# Altium schematic sheet rk3288.SchDoc
size A4
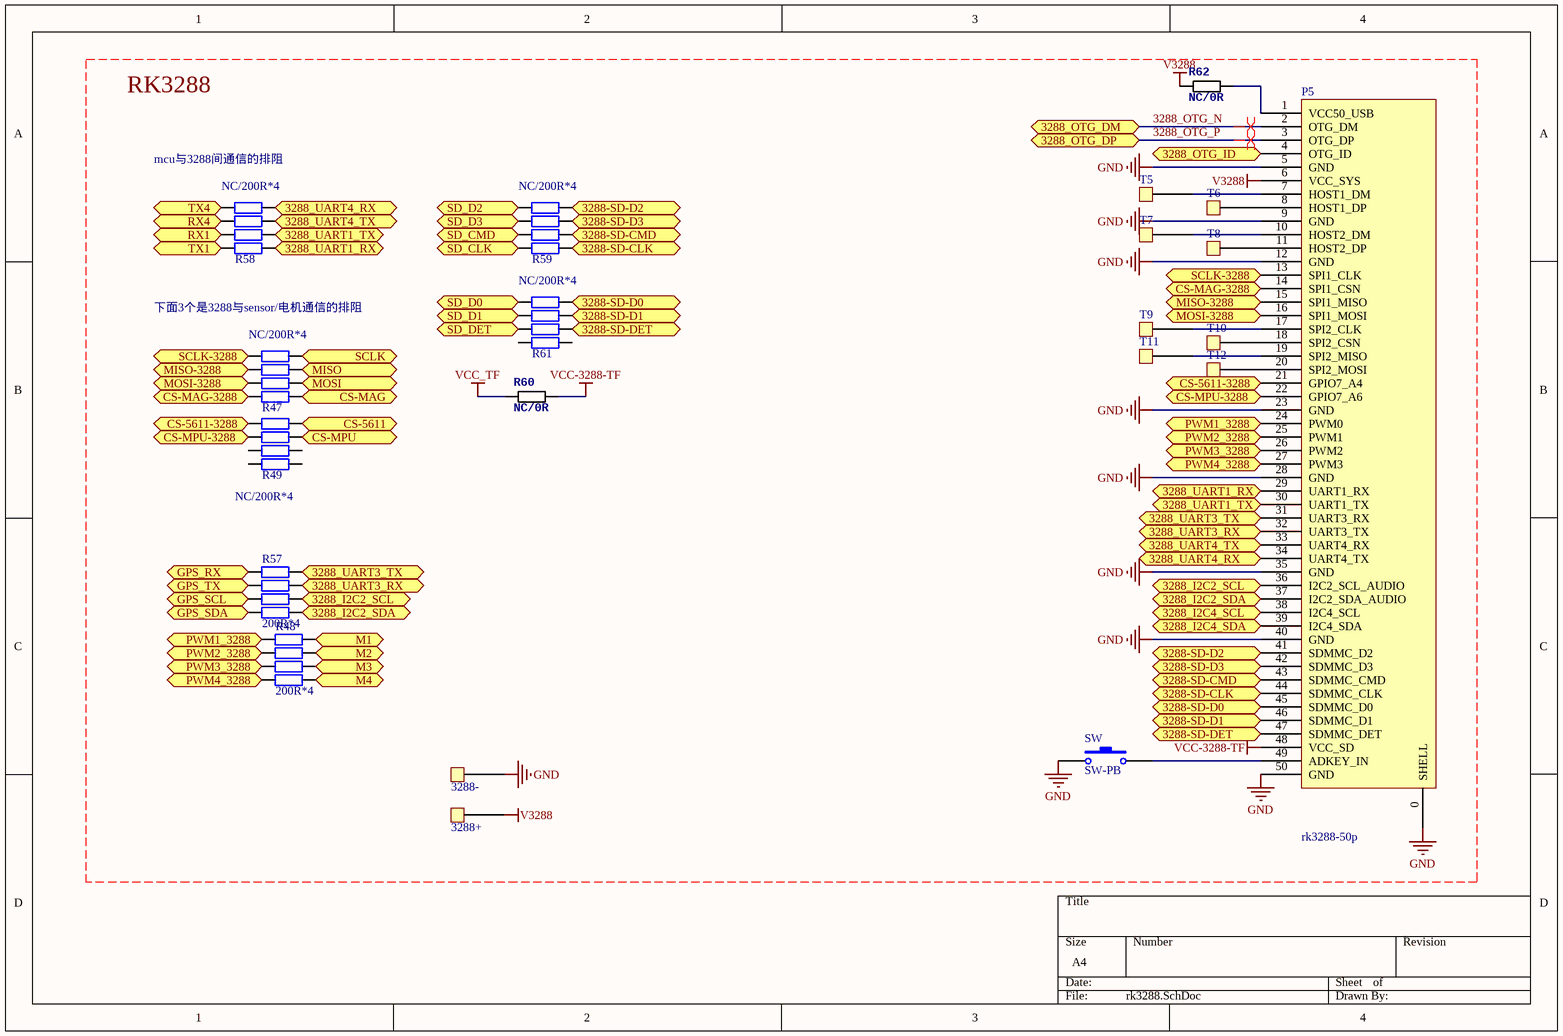
[diagram p0: rk3288.SchDoc]

## Parts
3288+  TestPad  [BatteryHole - 2mm]  (value not drawn)
3288-  TestPad  [BatteryHole - 2mm]  (value not drawn)
P5  rk3288-50p  [FPC-0.5mm-50-revert]
R47  NC/200R*4  [0402X4]
R48  200R*4  [0402X4]
R49  NC/200R*4  [0402X4]
R57  200R*4  [0402X4]
R58  NC/200R*4  [0402X4]
R59  NC/200R*4  [0402X4]
R60  NC/0R  [0402]
R61  NC/200R*4  [0402X4]
R62  NC/0R  [0402]
SW  SW-PB  [SW1]
T5  TestPad  [TestPad - 1mm]  (value not drawn)
T6  TestPad  [TestPad - 1mm]  (value not drawn)
T7  TestPad  [TestPad - 1mm]  (value not drawn)
T8  TestPad  [TestPad - 1mm]  (value not drawn)
T9  TestPad  [TestPad - 1mm]  (value not drawn)
T10  TestPad  [TestPad - 1mm]  (value not drawn)
T11  TestPad  [TestPad - 1mm]  (value not drawn)
T12  TestPad  [TestPad - 1mm]  (value not drawn)

## Ports
3288-SD-CLK, 3288-SD-CMD, 3288-SD-D0, 3288-SD-D1, 3288-SD-D2, 3288-SD-D3, 3288-SD-DET, 3288_I2C2_SCL, 3288_I2C2_SDA, 3288_I2C4_SCL, 3288_I2C4_SDA, 3288_OTG_DM, 3288_OTG_DP, 3288_OTG_ID, 3288_UART1_RX, 3288_UART1_TX, 3288_UART3_RX, 3288_UART3_TX, 3288_UART4_RX, 3288_UART4_TX, CS-5611, CS-5611-3288, CS-MAG (bidir), CS-MAG-3288 (bidir), CS-MPU, CS-MPU-3288, GPS_RX, GPS_SCL, GPS_SDA, GPS_TX, M1, M2, M3, M4, MISO, MISO-3288, MOSI, MOSI-3288, PWM1_3288, PWM2_3288, PWM3_3288, PWM4_3288, RX1, RX4, SCLK, SCLK-3288, SD_CLK, SD_CMD, SD_D0, SD_D1, SD_D2, SD_D3, SD_DET, TX1, TX4

## Nets
GND: 3288-.1 P5.0(SHELL) P5.5(GND) P5.9(GND) P5.12(GND) P5.23(GND) P5.28(GND) P5.35(GND) P5.40(GND) P5.50(GND) SW.1
V3288: 3288+.1 P5.6(VCC_SYS) R62.1
VCC-3288-TF: P5.48(VCC_SD) R60.2
VCC_TF: R60.1
3288-SD-CLK: P5.44(SDMMC_CLK) R59.5 ; port 3288-SD-CLK
3288-SD-CMD: P5.43(SDMMC_CMD) R59.6 ; port 3288-SD-CMD
3288-SD-D0: P5.45(SDMMC_D0) R61.8 ; port 3288-SD-D0
3288-SD-D1: P5.46(SDMMC_D1) R61.7 ; port 3288-SD-D1
3288-SD-D2: P5.41(SDMMC_D2) R59.8 ; port 3288-SD-D2
3288-SD-D3: P5.42(SDMMC_D3) R59.7 ; port 3288-SD-D3
3288-SD-DET: P5.47(SDMMC_DET) R61.6 ; port 3288-SD-DET
3288_I2C2_SCL: P5.36(I2C2_SCL_AUDIO) R57.2 ; port 3288_I2C2_SCL
3288_I2C2_SDA: P5.37(I2C2_SDA_AUDIO) R57.1 ; port 3288_I2C2_SDA
3288_I2C4_SCL: P5.38(I2C4_SCL) ; port 3288_I2C4_SCL
3288_I2C4_SDA: P5.39(I2C4_SDA) ; port 3288_I2C4_SDA
3288_OTG_ID: P5.4(OTG_ID) ; port 3288_OTG_ID
3288_OTG_N: P5.2(OTG_DM) ; port 3288_OTG_DM
3288_OTG_P: P5.3(OTG_DP) ; port 3288_OTG_DP
3288_UART1_RX: P5.29(UART1_RX) R58.5 ; port 3288_UART1_RX
3288_UART1_TX: P5.30(UART1_TX) R58.6 ; port 3288_UART1_TX
3288_UART3_RX: P5.32(UART3_TX) R57.3 ; port 3288_UART3_RX
3288_UART3_TX: P5.31(UART3_RX) R57.4 ; port 3288_UART3_TX
3288_UART4_RX: P5.34(UART4_TX) R58.8 ; port 3288_UART4_RX
3288_UART4_TX: P5.33(UART4_RX) R58.7 ; port 3288_UART4_TX
CS-5611: R49.8 ; port CS-5611
CS-5611-3288: P5.21(GPIO7_A4) R49.1 ; port CS-5611-3288
CS-MAG: R47.5 ; port CS-MAG
CS-MAG-3288: P5.14(SPI1_CSN) R47.4 ; port CS-MAG-3288
CS-MPU: R49.7 ; port CS-MPU
CS-MPU-3288: P5.22(GPIO7_A6) R49.2 ; port CS-MPU-3288
GPS_RX: R57.5 ; port GPS_RX
GPS_SCL: R57.7 ; port GPS_SCL
GPS_SDA: R57.8 ; port GPS_SDA
GPS_TX: R57.6 ; port GPS_TX
M1: R48.1 ; port M1
M2: R48.2 ; port M2
M3: R48.3 ; port M3
M4: R48.4 ; port M4
MISO: R47.7 ; port MISO
MISO-3288: P5.15(SPI1_MISO) R47.2 ; port MISO-3288
MOSI: R47.6 ; port MOSI
MOSI-3288: P5.16(SPI1_MOSI) R47.3 ; port MOSI-3288
PWM1_3288: P5.24(PWM0) R48.8 ; port PWM1_3288
PWM2_3288: P5.25(PWM1) R48.7 ; port PWM2_3288
PWM3_3288: P5.26(PWM2) R48.6 ; port PWM3_3288
PWM4_3288: P5.27(PWM3) R48.5 ; port PWM4_3288
RX1: R58.3 ; port RX1
RX4: R58.2 ; port RX4
SCLK: R47.8 ; port SCLK
SCLK-3288: P5.13(SPI1_CLK) R47.1 ; port SCLK-3288
SD_CLK: R59.4 ; port SD_CLK
SD_CMD: R59.3 ; port SD_CMD
SD_D0: R61.1 ; port SD_D0
SD_D1: R61.2 ; port SD_D1
SD_D2: R59.1 ; port SD_D2
SD_D3: R59.2 ; port SD_D3
SD_DET: R61.3 ; port SD_DET
TX1: R58.4 ; port TX1
TX4: R58.1 ; port TX4
NetP5_1: P5.1(VCC50_USB) R62.2
NetP5_7: P5.7(HOST1_DM) T5.1
NetP5_8: P5.8(HOST1_DP) T6.1
NetP5_10: P5.10(HOST2_DM) T7.1
NetP5_11: P5.11(HOST2_DP) T8.1
NetP5_17: P5.17(SPI2_CLK) T9.1
NetP5_18: P5.18(SPI2_CSN) T10.1
NetP5_19: P5.19(SPI2_MISO) T11.1
NetP5_20: P5.20(SPI2_MOSI) T12.1
NetP5_49: P5.49(ADKEY_IN) SW.2

Not connected (* = marked no-connect by the designer): R49 3 4 5 6; R61 4 5

## Layout directives
differential pair: 3288_OTG_N, 3288_OTG_P

## Notes on the sheet
- RK3288
- (near R58) mcu与3288间通信的排阻
- 下面3个是3288与sensor/电机通信的排阻

## Library data of the parts
R47-R49 R57-R59 R61 = Res*4: Resistor; Published: 8-Jun-2000; LatestRevisionDate: 17-Jul-2002; LatestRevisionNote: Re-released for DXP Platform.; PackageReference: AXIAL-0.4; Publisher: Altium Limited; PackageDescription: Axial Device, Thru-Hole; 2 Leads; 0.4 in Pin Spacing
R60 R62 = RESISTOR0603B: <b>Resistor</b> / Basic schematic elements and footprints for 0603, 1206, and PTH 1/10th watt (small) resistors.; PARTNO: RMCF0402FT453K
SW = SW-PB: Switch; Published: 24-Mar-1999; LatestRevisionDate: 17-Jul-2002; LatestRevisionNote: Re-released for DXP Platform.; PackageReference: SPST-2; Publisher: Altium Limited; PackageDescription: Switch; 2 Leads